# Altium schematic sheet ACS_Board_Schematic.SchDoc
size A
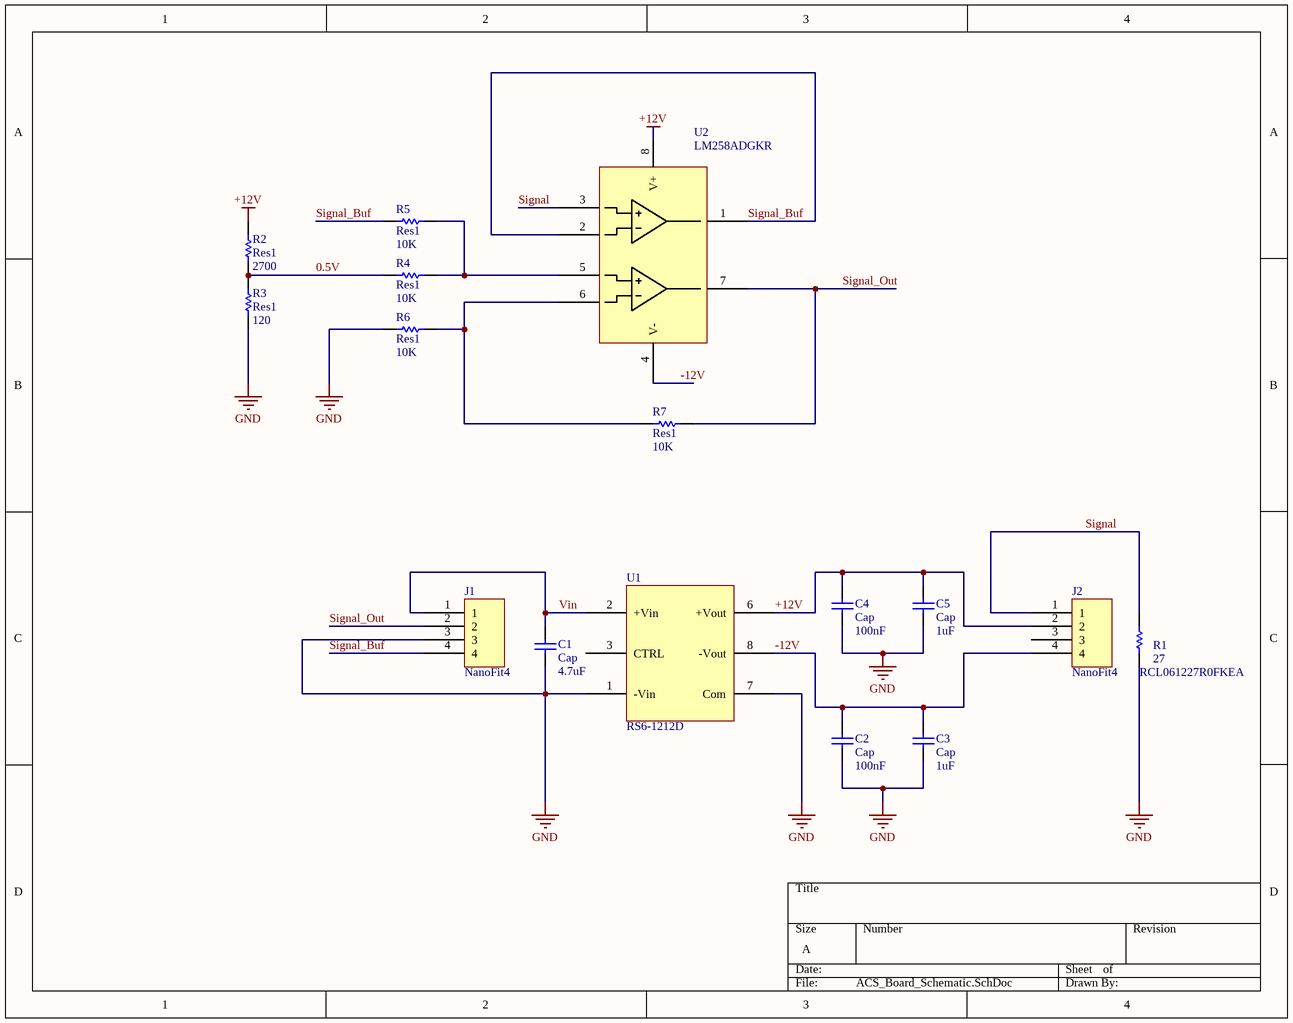
[diagram p0: ACS_Board_Schematic.SchDoc]

## Parts
C1  Cap  value 4.7uF  [CAPC2012X12N]
C2  Cap  value 100nF  [CAPC1608X08N]
C3  Cap  value 1uF  [CAPC1608X08N]
C4  Cap  value 100nF  [CAPC1608X08N]
C5  Cap  value 1uF  [CAPC1608X08N]
J1  NanoFit4  [1053141304]
J2  NanoFit4  [1053141304]
R1  RCL061227R0FKEA  [RCL061227R0FKEA]
R2  Res1  value 2700  [RESC1608X06N]
R3  Res1  value 120  [RESC1608X06N]
R4  Res1  value 10K  [RESC1608X06N]
R5  Res1  value 10K  [RESC1608X06N]
R6  Res1  value 10K  [RESC1608X06N]
R7  Res1  value 10K  [RESC1608X06N]
U1  RS6-1212D  [RS6-1212D]
U2  LM258ADGKR  [TSOP65P640X120-8N]

## Nets
+12V: C4.2 C5.2 J2.2 R2.2 U1.6(+Vout) U2.8(V+)
GND: C1.1 C2.1 C3.1 C4.1 C5.1 J1.3 R1.1 R3.1 R6.1 U1.1(-Vin) U1.7(Com)
0.5V: R2.1 R3.2 R4.1
-12V: C2.2 C3.2 J2.4 U1.8(-Vout) U2.4(V-)
Signal: J2.1 R1.2 U2.3(IN1+)
Signal_Buf: J1.4 R5.1 U2.1(OUT1) U2.2(IN1-)
Signal_Out: J1.2 R7.2 U2.7(OUT2)
Vin: C1.2 J1.1 U1.2(+Vin)
NetR4_2: R4.2 R5.2 U2.5(IN2+)
NetR6_2: R6.2 R7.1 U2.6(IN2-)

Not connected (* = marked no-connect by the designer): J2 3; U1 3(CTRL)

## Notes on the sheet
- (in symbol Res1) 27

## Library data of the parts
C1-C5 = Cap: Capacitor; Published: 8-Jun-2000; LatestRevisionDate: 17-Jul-2002; LatestRevisionNote: Re-released for DXP Platform.; PackageReference: RAD-0.3; Publisher: Altium Limited; PackageDescription: Radial Cap, Thru-Hole; 2 Leads; 0.3 in Pin Spacing
R1-R7 = Res1: Resistor; Published: 8-Jun-2000; LatestRevisionDate: 17-Jul-2002; LatestRevisionNote: Re-released for DXP Platform.; PackageReference: AXIAL-0.3; Publisher: Altium Limited; PackageDescription: Axial Device, Thru-Hole; 2 Leads; 0.3 in Pin Spacing
U2 = OPAMP2